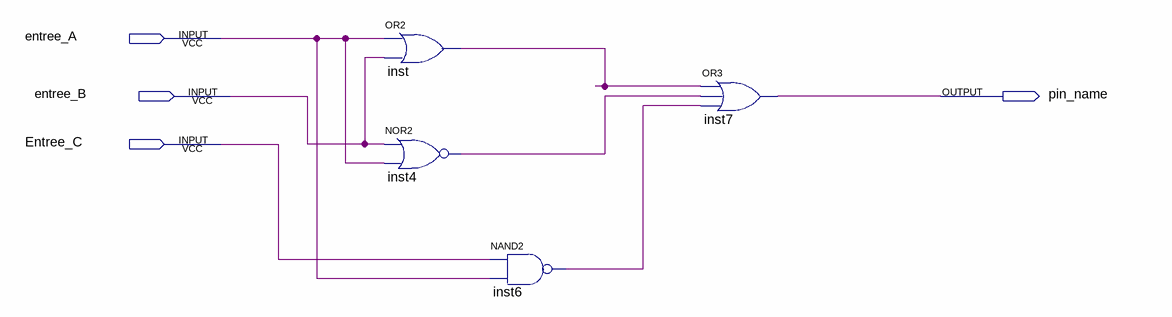
[diagram p0: schematic sheet]
// Quartus schematic demoSLO_schematique.bdf as structural Verilog: 4 symbols, 4 pins
module demoSLO_schematique (
  input  entree_A,
  input  entree_B,
  input  Entree_C,
  output pin_name
);

  wire inst4_out, inst6_out, inst_out;

  or inst (inst_out, entree_A, entree_B);
  nor inst4 (inst4_out, entree_B, entree_A);
  nand inst6 (inst6_out, Entree_C, entree_A);
  or inst7 (pin_name, inst_out, inst4_out, inst6_out);
endmodule
